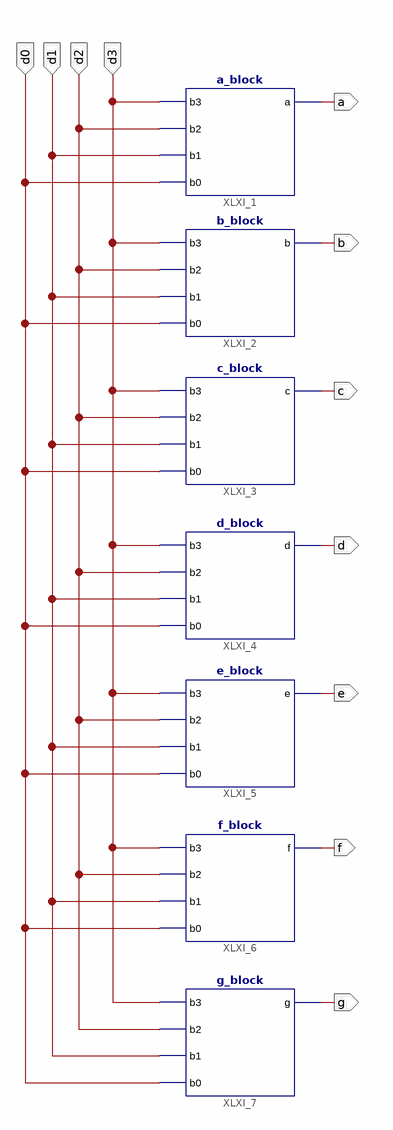
[diagram p0: schematic sheet 1]
// Xilinx ISE schematic bcdto7segment.sch (xc9500xl) as structural Verilog: 7 symbols, 11 ports
module bcdto7segment (
  input  d3,
  input  d2,
  input  d1,
  input  d0,
  output a,
  output b,
  output c,
  output d,
  output e,
  output f,
  output g
);

  a_block XLXI_1 (.a(a), .b0(d0), .b1(d1), .b2(d2), .b3(d3));
  b_block XLXI_2 (.b(b), .b0(d0), .b1(d1), .b2(d2), .b3(d3));
  c_block XLXI_3 (.b0(d0), .b1(d1), .b2(d2), .b3(d3), .c(c));
  d_block XLXI_4 (.b0(d0), .b1(d1), .b2(d2), .b3(d3), .d(d));
  e_block XLXI_5 (.b0(d0), .b1(d1), .b2(d2), .b3(d3), .e(e));
  f_block XLXI_6 (.b0(d0), .b1(d1), .b2(d2), .b3(d3), .f(f));
  g_block XLXI_7 (.b0(d0), .b1(d1), .b2(d2), .b3(d3), .g(g));
endmodule
